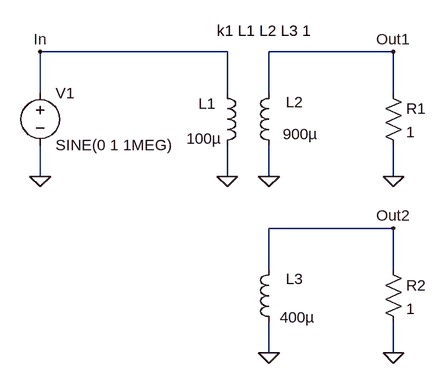
[diagram p0: schematic Tutorial2.asc]
Tutorial2.asc, the LTspice schematic file:
Version 4.1
SHEET 1 880 680
WIRE 352 80 64 80
WIRE 608 80 416 80
WIRE 64 144 64 80
WIRE 352 144 352 80
WIRE 416 144 416 80
WIRE 608 144 608 80
WIRE 64 272 64 224
WIRE 352 272 352 224
WIRE 416 272 416 224
WIRE 608 272 608 224
WIRE 608 352 416 352
WIRE 416 416 416 352
WIRE 608 416 608 352
WIRE 416 544 416 496
WIRE 608 544 608 496
FLAG 64 272 0
FLAG 352 272 0
FLAG 416 272 0
FLAG 608 272 0
FLAG 64 80 In
FLAG 608 80 Out1
FLAG 416 544 0
FLAG 608 544 0
FLAG 608 352 Out2
SYMBOL voltage 64 128 R0
WINDOW 123 0 0 Left 0
WINDOW 39 0 0 Left 0
SYMATTR InstName V1
SYMATTR Value SINE(0 1 1MEG)
SYMBOL res 592 128 R0
SYMATTR InstName R1
SYMATTR Value 1
SYMBOL ind 336 128 R0
WINDOW 0 -28 32 Left 2
WINDOW 3 -47 86 Left 2
SYMATTR InstName L1
SYMATTR Value 100µ
SYMATTR Type ind
SYMBOL ind 432 128 M0
WINDOW 0 -37 30 Left 2
WINDOW 3 -60 79 Left 2
SYMATTR InstName L2
SYMATTR Value 900µ
SYMATTR Type ind
SYMBOL res 592 400 R0
SYMATTR InstName R2
SYMATTR Value 1
SYMBOL ind 432 400 M0
WINDOW 0 -37 30 Left 2
WINDOW 3 -55 89 Left 2
SYMATTR InstName L3
SYMATTR Value 400µ
SYMATTR Type ind
TEXT 336 48 Left 2 !k1 L1 L2 L3 1

The netlist it stands for:
* Tutorial2.asc
V1 In 0 SINE(0 1 1MEG)
R1 Out1 0 1
L1 In 0 100µ
L2 Out1 0 900µ
R2 Out2 0 1
L3 Out2 0 400µ
k1 L1 L2 L3 1
.backanno
.end